# Altium schematic sheet Buzzer.SchDoc: Shipwars Buzzer Schematic
size 431 x 279 mm; CheckedBy: SP, PS; Author: SP, PS; CompanyName: UPenn; DrawnBy: SP, PS; Engineer: SP, PS; Organization: UPenn; Address1: 200 S 33rd Street; Address2: Detkin Lab; Address3: Philadelphia; Address4: PA 19104; Revision: .1.0.0; SheetNumber: 10; SheetTotal: 10; Project: Shipwars
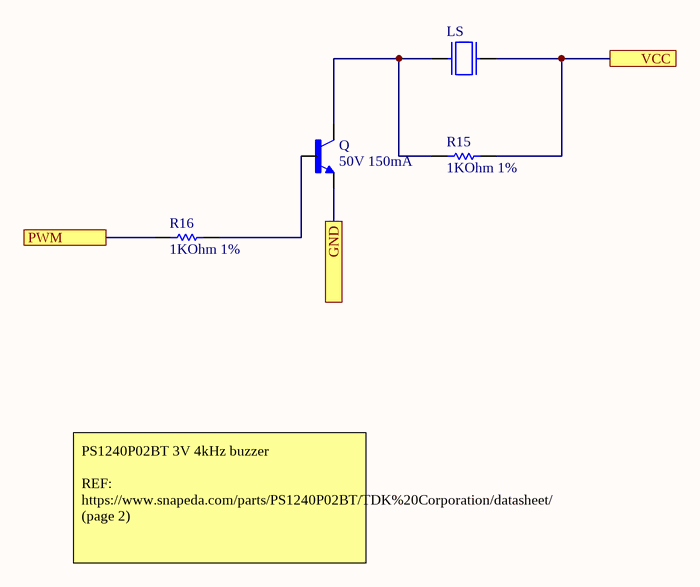
[diagram p0: Buzzer.SchDoc]

## Parts
LS  PS1240P02BT  [PS1240P02BT]  (value not drawn)
Q  50V 150mA  [2SC1815]
R15  1KOhm 1%  [RESC0603(1608)_M]
R16  1KOhm 1%  [RESC0603(1608)_M]

## Ports
GND, PWM, VCC

## Nets
GND: Q.1(E) ; port GND
PWM: R16.1 ; port PWM
VCC: LS.2 R15.2 ; port VCC
NetLS_1: LS.1 Q.2(C) R15.1
NetQ_3: Q.3(B) R16.2

## Notes on the sheet
- PS1240P02BT 3V 4kHz buzzer
  REF: https://www.snapeda.com/parts/PS1240P02BT/TDK%20Corporation/datasheet/ (page 2)
- DWG. NO.
- REV.
- SHT.
- THIS DOCUMENT AND THE DATA DISCLOSED HEREIN OR HEREWITH IS THE PROPERTY OF ALTIUM LIMITED AND MAY BE FREELY DISTRIBUTED IN WHOLE. NO RIGHTS ARE RESERVED OR EXPRESS OR IMPLIED WARANTEE GIVEN.
- REVISION
- DESCRIPTION
- DATE
- APPROVED
- ENG:
- APPROVALS
- PROJECT
- DSN:
- CHK:
- REFERENCE DOCUMENTS
- PROJECT REVISION:
- TITLE
- DOCUMENT REVISION:
- DESIGN ITEM:
- BOM:
- FAB DWG:
- PCB DWG:
- ASSY DWG:
- SCALE:
- SIZE
- B
- CAGE CODE
- FILE NAME
- DWG NO.
- SHEET
- OF
- REV

## Library data of the parts
LS = PS1240P02BT: TDK - PS1240P02BT - BUZZER, PIEZO, 70DB, 12.2MM; Number of Terminals/Pins: 2; Frequency: 4kHz; Operating Supply Voltage: 3V; Washable: No; MP: PS1240P02BT; Availability: Unavailable; Package: 2020 TDK; MF: TDK; Value: *; Price: None; SnapEDA_Link: https://www.snapeda.com/parts/PS1240P02BT/TDK/view-part/53420/?ref=snap; Supplier 1: Digi-Key; Supplier Part Number 1: 445-2525-1-ND; Manufacturer: TDK; Manufacturer Part Number: PS1240P02BT; RoHS: Yes; Category: Audio Products; Stock 1: 31933; Pricing 1: 1=0.61000, 10=0.52500, 25=0.49120, 50=0.46580, 100=0.44110 (USD); Mount: Through Hole; Number of Pins: 2; Min Operating Temperature: -10°C; Max Operating Temperature: 70°C; Termination: PC Pins; Package Quantity: 1; Packaging: Tape and Reel; Voltage Rating (DC): 3V; Series: PS; Diameter: 12.2mm; Height: 6.5mm; Lead Free: Lead Free; RoHS Compliant: Yes; ComponentLink1URL: https://datasheet.ciiva.com/0/ef532-ps-112.pdf?src-supplier=Digi-Key; ComponentLink1Description: https://datasheet.ciiva.com/0/ef532-ps-112.pdf?src-supplier=Digi-Key; ComponentLink2URL: https://datasheet.ciiva.com/0/ef532-ps-111.pdf?src-supplier=Digi-Key; ComponentLink2Description: https://datasheet.ciiva.com/0/ef532-ps-111.pdf?src-supplier=Digi-Key; ComponentLink3URL: https://datasheet.ciiva.com/3306/ef532-ps-3306958.pdf?src-supplier=Avnet; ComponentLink3Description: https://datasheet.ciiva.com/3306/ef532-ps-3306958.pdf?src-supplier=Avnet; ComponentLink4URL: https://datasheet.ciiva.com/16225/ef532-ps-16225062.pdf?src-supplier=Onlinecomponents.com; ComponentLink4Description: https://datasheet.ciiva.com/16225/ef532-ps-16225062.pdf?src-supplier=Onlinecomponents.com
Q = 2SC1815: Transistor GP BJT NPN 50V 150mA 3-Pin TO-92 Box 2SC1815; Manufacturer Part Number: 2SC1815 PBFREE; MF: Central Semiconductor; Package: - Central Semiconductor; Availability: Unavailable; MP: 2SC1815; Value: *; SnapEDA_Link: https://www.snapeda.com/parts/2SC1815/Central%20Semiconductor/view-part/4614189/?ref=snap; Price: None; Supplier 1: Digi-Key; Supplier Part Number 1: 1514-2SC1815PBFREE-ND; Manufacturer: Central Semiconductor; RoHS: Yes; Stock 1: 8551; Pricing 1: 1=0.98000, 10=0.87700, 100=0.68340, 500=0.56458, 1000=0.44572, 2000=0.42050 (USD); RoHS Compliant: Yes
R15 R16 = CMP-1012-00510-1: 1K 0.1W 1% 0603 (1608 Metric)  SMD; Case-Metric: 1608; Case-EIA: 0603; Value: 1000.00 Ohm; Technology: SMT; Tolerance: 1 %; Power: 0.1 W